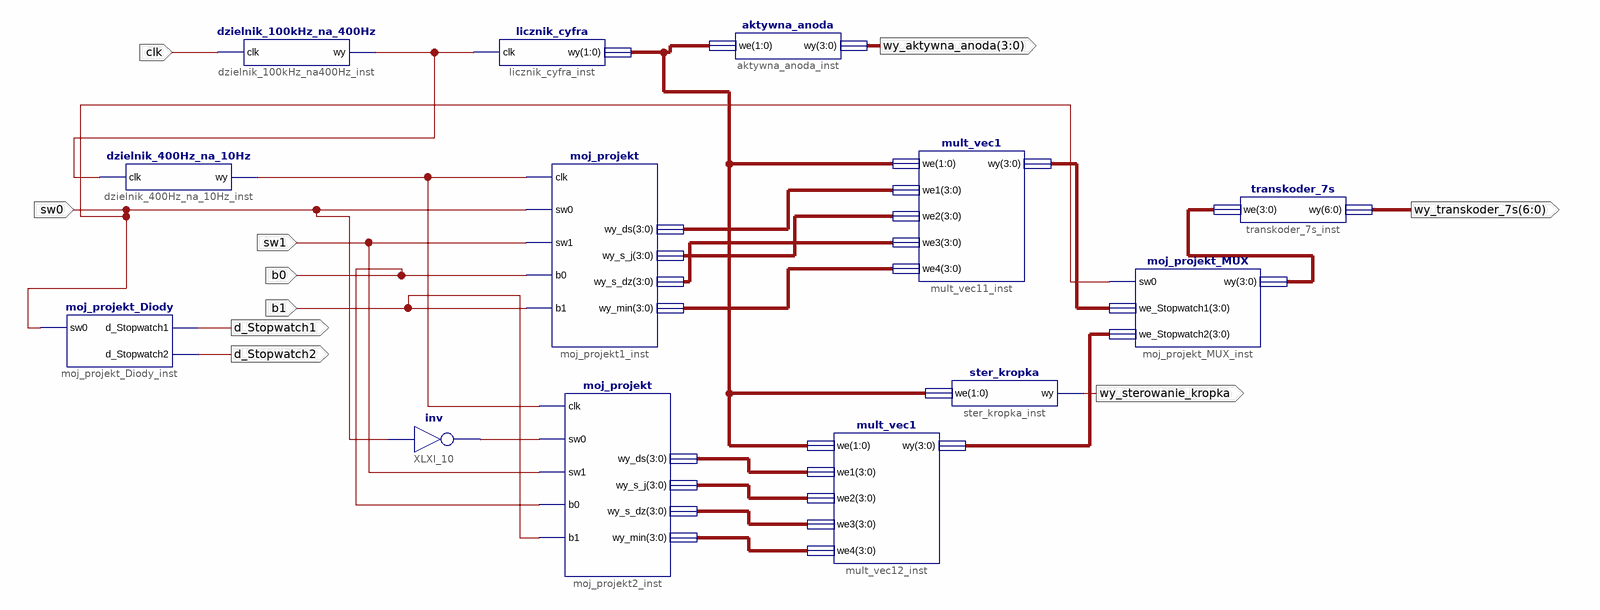
[diagram p0: schematic sheet 1]
// Xilinx ISE schematic SchematGlowny.sch (xbr) as structural Verilog: 13 symbols, 10 ports
module SchematGlowny (
  input  clk,
  input  sw0,
  input  sw1,
  input  b0,
  input  b1,
  output d_Stopwatch1,
  output d_Stopwatch2,
  output wy_sterowanie_kropka,
  output [3:0] wy_aktywna_anoda,
  output [6:0] wy_transkoder_7s
);

  wire XLXN_3, XLXN_30, XLXN_32;
  wire [1:0] XLXN_61;
  wire [3:0] XLXN_49, XLXN_50, XLXN_51, XLXN_53, XLXN_54, XLXN_55, XLXN_56, XLXN_57, XLXN_58, XLXN_59,
       XLXN_60;

  dzielnik_100kHz_na_400Hz dzielnik_100kHz_na400Hz_inst (.clk(clk), .wy(XLXN_3));
  licznik_cyfra licznik_cyfra_inst (.clk(XLXN_3), .wy(XLXN_61));
  aktywna_anoda aktywna_anoda_inst (.we(XLXN_61), .wy(wy_aktywna_anoda));
  moj_projekt moj_projekt1_inst (
    .clk(XLXN_32), .sw0(sw0), .sw1(sw1), .b0(b0), .b1(b1), .wy_ds(XLXN_49), .wy_s_j(XLXN_50),
    .wy_s_dz(XLXN_51), .wy_min(XLXN_53));
  mult_vec1 mult_vec11_inst (.we(XLXN_61), .we1(XLXN_49), .we2(XLXN_50), .we3(XLXN_51), .we4(XLXN_53), .wy(XLXN_59));
  dzielnik_400Hz_na_10Hz dzielnik_400Hz_na_10Hz_inst (.clk(XLXN_3), .wy(XLXN_32));
  moj_projekt moj_projekt2_inst (
    .clk(XLXN_32), .sw0(XLXN_30), .sw1(sw1), .b0(b0), .b1(b1), .wy_ds(XLXN_54), .wy_s_j(XLXN_55),
    .wy_s_dz(XLXN_56), .wy_min(XLXN_57));
  moj_projekt_Diody moj_projekt_Diody_inst (.sw0(sw0), .d_Stopwatch1(d_Stopwatch1), .d_Stopwatch2(d_Stopwatch2));
  not XLXI_10 (XLXN_30, sw0);
  ster_kropka ster_kropka_inst (.we(XLXN_61), .wy(wy_sterowanie_kropka));
  transkoder_7s transkoder_7s_inst (.we(XLXN_60), .wy(wy_transkoder_7s));
  mult_vec1 mult_vec12_inst (.we(XLXN_61), .we1(XLXN_54), .we2(XLXN_55), .we3(XLXN_56), .we4(XLXN_57), .wy(XLXN_58));
  moj_projekt_MUX moj_projekt_MUX_inst (.sw0(sw0), .we_Stopwatch1(XLXN_59), .we_Stopwatch2(XLXN_58), .wy(XLXN_60));
endmodule
